# EAGLE design dual HX711 loadcell hytech v1.1 (EAGLE 9.5.0)
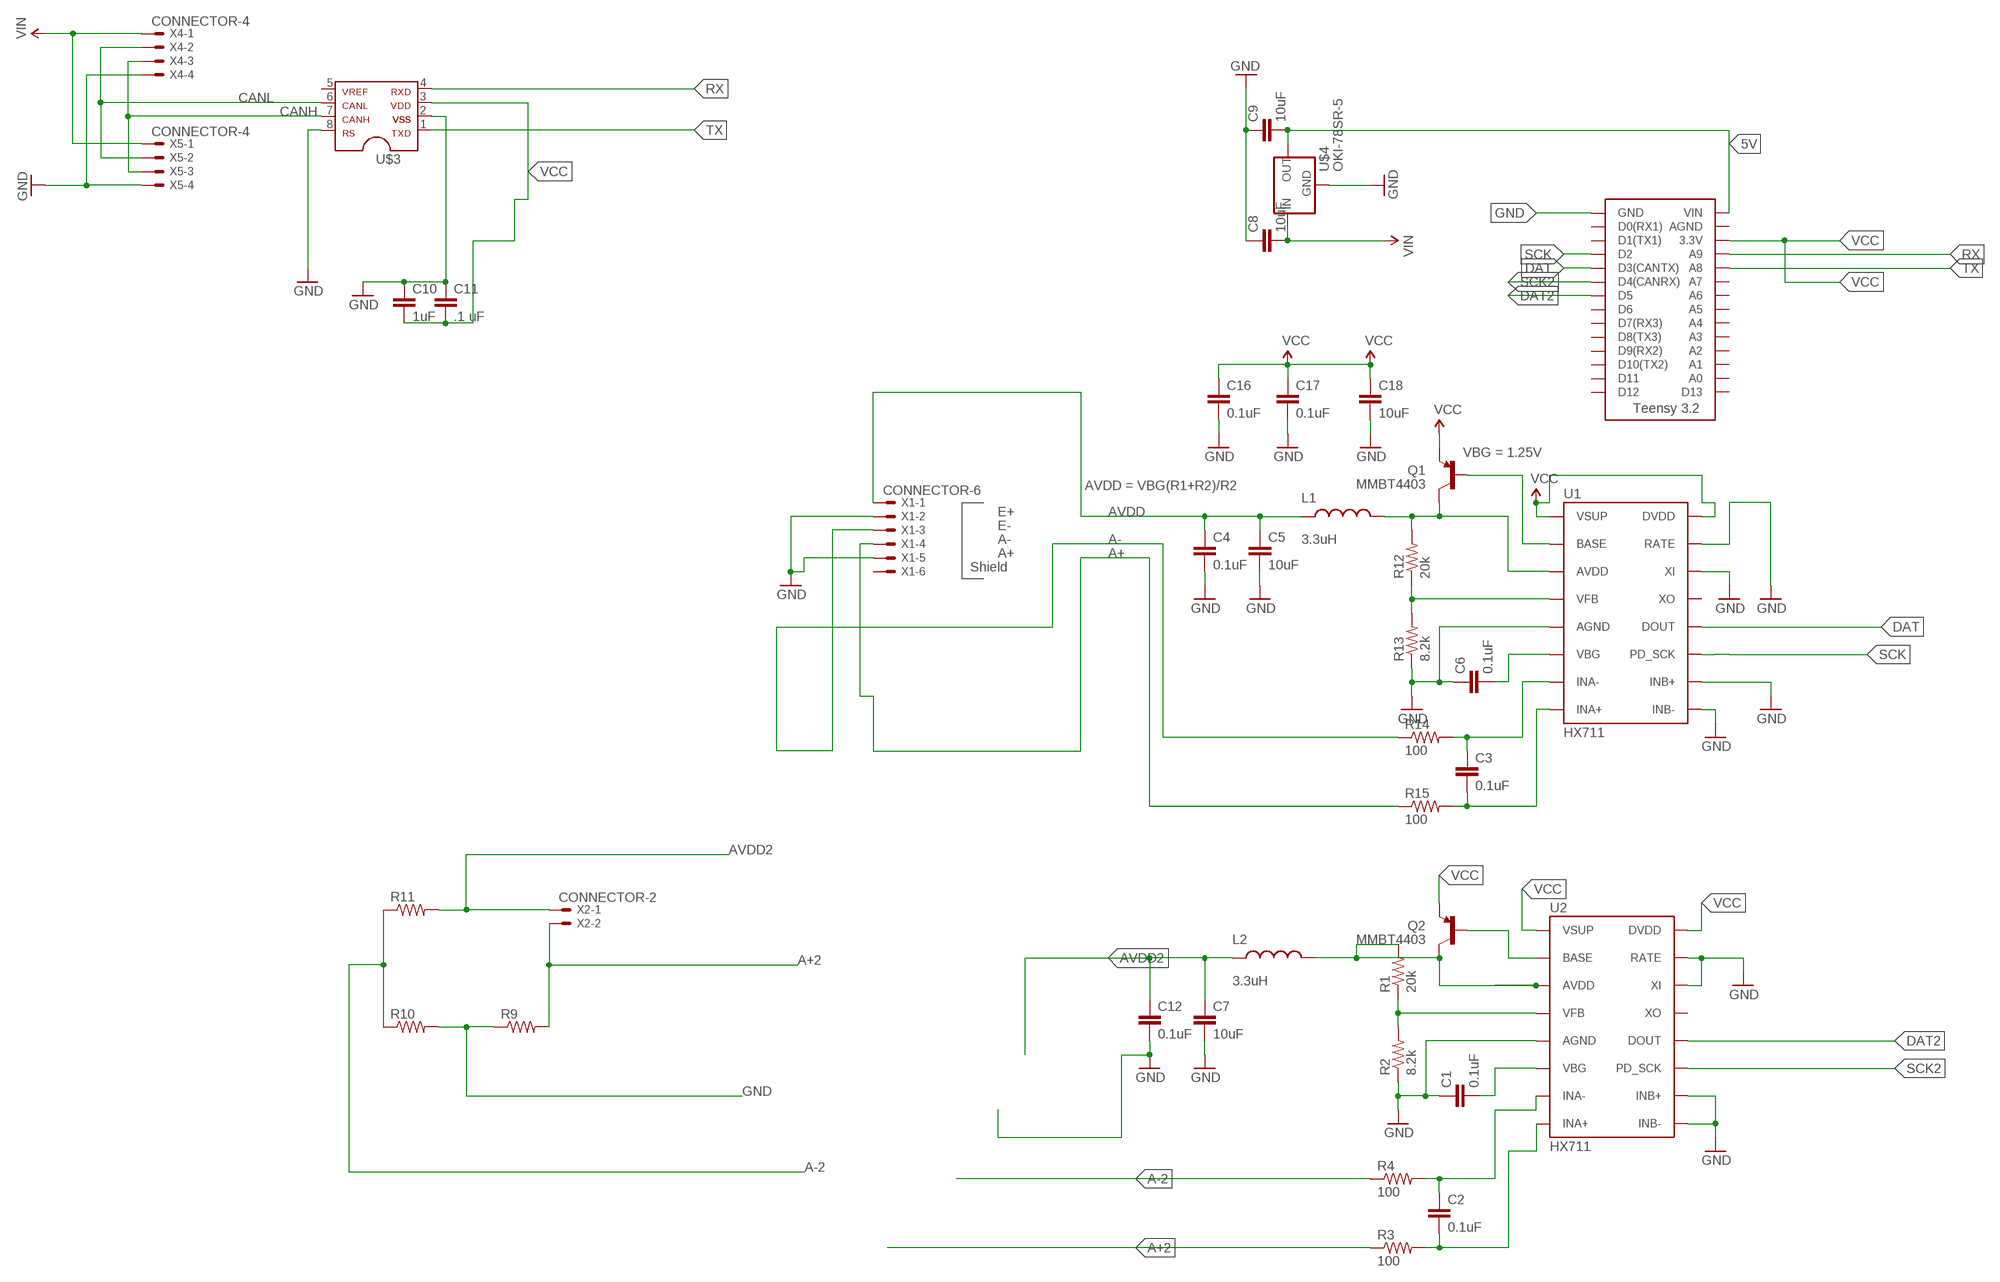
[diagram p0: schematic, sheet 1]

## Parts
C1  0.1uF  CAP0805  [0805]
C2  0.1uF  CAP0805  [0805]
C3  0.1uF  CAP0805  [0805]
C4  0.1uF  CAP0805  [0805]
C5  10uF  CAP0805  [0805]
C6  0.1uF  CAP0805  [0805]
C7  10uF  CAP0805  [0805]
C8  10uF  CAP0805  [0805]
C9  10uF  CAP0805  [0805]
C10  1uF  CAP0805  [0805]
C11  .1 uF  CAP0805  [0805]
C12  0.1uF  CAP0805  [0805]
C16  0.1uF  CAP0805  [0805]
C17  0.1uF  CAP0805  [0805]
C18  10uF  CAP0805  [0805]
L1  3.3uH  INDUCTOR0805-IND  [0805]
L2  3.3uH  INDUCTOR0805-IND  [0805]
Q1  MMBT4403  TRANSISTOR_PNPMMBT4403  [SOT23-3]
Q2  MMBT4403  TRANSISTOR_PNPMMBT4403  [SOT23-3]
R1  20k  RESISTOR0805-RES  [0805]
R2  8.2k  RESISTORAXIAL-0.3  [AXIAL-0.3]
R3  100  RESISTORAXIAL-0.3  [AXIAL-0.3]
R4  100  RESISTORAXIAL-0.3  [AXIAL-0.3]
R9  RESISTOR0805-RES  [0805]
R10  RESISTOR0805-RES  [0805]
R11  RESISTOR0805-RES  [0805]
R12  20k  RESISTOR0805-RES  [0805]
R13  8.2k  RESISTORAXIAL-0.3  [AXIAL-0.3]
R14  100  RESISTORAXIAL-0.3  [AXIAL-0.3]
R15  100  RESISTORAXIAL-0.3  [AXIAL-0.3]
U1  HX711  HX711HX711  [SO16]
U2  HX711  HX711HX711  [SO16]
U$1  TEENSY_3.2_SIMPLE  [TEENSY_3.2_SIMPLE]
U$3  MCP2551  [SOIC-08]
U$4  OKI-78SR-5  [OKI-78SR]
X1  CONNECTOR-6  [MINIFIT_5566-6]
X2  CONNECTOR-2  [MINIFIT_5566-2]
X4  CONNECTOR-4  [MINIFIT_5566-4]
X5  CONNECTOR-4  [MINIFIT_5566-4]

## Nets
5V: C9.2 U$1.VIN U$4.3(OUT)
A+: R15.P$1 X1.4
A+2: R3.P$1 R9.2 X2.2
A-: R14.P$1 X1.3
A-2: R4.P$1 R10.1 R11.1
AVDD: C4.1 C5.1 L1.1 X1.1
AVDD2: C7.1 C12.1 L2.1 R11.2 X2.1
CANH: U$3.7 X4.3 X5.3
CANL: U$3.6 X4.2 X5.2
DAT: U1.12(DOUT) U$1.D3(CANTX)
DAT2: U2.12(DOUT) U$1.D5
GND: C1.1 C4.2 C5.2 C6.1 C7.2 C8.1 C9.1 C10.1 C11.1 C12.2 C16.2 C17.2 C18.2 R2.P$1 R9.1 R10.2 R13.P$1 U1.5(AGND) U1.9(INB-) U1.10(INB+) U1.14(XI) U1.15(RATE) U2.5(AGND) U2.9(INB-) U2.10(INB+) U2.14(XI) U2.15(RATE) U$1.GND U$3.2 U$3.8 U$4.2(GND) X1.2 X1.5 X4.4 X5.4
N$1: Q2.1(B) U2.2(BASE)
N$2: C3.1 R14.P$2 U1.7(INA-)
N$3: C3.2 R15.P$2 U1.8(INA+)
N$4: Q1.1(B) U1.2(BASE)
N$5: L1.2 Q1.3(C) R12.2 U1.3(AVDD)
N$6: R12.1 R13.P$2 U1.4(VFB)
N$7: C6.2 U1.6(VBG)
N$8: C2.1 R4.P$2 U2.7(INA-)
N$9: R1.1 R2.P$2 U2.4(VFB)
N$10: C1.2 U2.6(VBG)
N$11: L2.2 Q2.3(C) R1.2 U2.3(AVDD)
N$12: C2.2 R3.P$2 U2.8(INA+)
RX: U$1.A9 U$3.4
SCK: U1.11(PD_SCK) U$1.D2
SCK2: U2.11(PD_SCK) U$1.D4(CANRX)
TX: U$1.A8 U$3.1
VCC: C10.2 C11.2 C16.1 C17.1 C18.1 Q1.2(E) Q2.2(E) U1.1(VSUP) U1.16(DVDD) U2.1(VSUP) U2.16(DVDD) U$1.3.3V U$3.3
VIN: C8.2 U$4.1(IN) X4.1 X5.1
Unconnected: U1.13(XO) U2.13(XO) U$1.A0 U$1.A1 U$1.A2 U$1.A3 U$1.A4 U$1.A5 U$1.A6 U$1.A7 U$1.AGND U$1.D0(RX1) U$1.D1(TX1) U$1.D6 U$1.D7(RX3) U$1.D8(TX3) U$1.D9(RX2) U$1.D10(TX2) U$1.D11 U$1.D12 U$1.D13 U$3.5 X1.6

## Notes on the sheet
- VBG = 1.25V
- AVDD = VBG(R1+R2)/R2
- E+
- E-
- A-
- A+
- Shield

## Library data of the parts
C1-C12 C16-C18 = HyTechDevices:CAP: Capacitor Standard 0603 ceramic capacitor, and 0.1" leaded capacitor.
L1 L2 = SparkFun-Passives:INDUCTOR: Inductors Basic Inductor/Choke - 0603 and 1206. Footprints are not proven and vary greatly between part numbers. INDUCTOR POWER 3.3UH 4.0A SMD 0.197" L x 0.197" W x 0.177" H (5.00mm x 5.00mm x 4.50mm); PROD_ID: NDUC-13076
Q1 Q2 = SparkFun-DiscreteSemi:TRANSISTOR_PNP: Generic PNP BJT Double check pinouts against datasheets- not all devices are the same! MMBT3906 - 40V 200mA SOT-23 (TRANS-08052) MMBT4403 - 40V 600mA SOT-23 (TRANS-09245); PROD_ID: TRANS-09245
R1-R4 R9-R15 = HyTechDevices:RESISTOR: Resistor Basic schematic elements and footprints for 0603, 1206, and PTH resistors.
U1 U2 = Testing:HX711; PROD_ID: IC-12445
U$1 = HyTechDevices:TEENSY_3.2_SIMPLE: Simple version of the Teensy 3.2 board that only uses the 2 main rows of pins, not the inner pins or the pins opposite the usb port.
U$3 = HyTechDevices:MCP2551: MCP2551 High-Speed CAN Transceiver Product Webpage <https://www.microchip.com/wwwproducts/en/MCP2551> Datasheet <http://ww1.microchip.com/downloads/en/DeviceDoc/21667f.pdf> This device is outdated It is replaced by MCP2561. Comparison Page <https://www.microchip.com/wwwproducts/ProductCompare/MCP2551/MCP2561> Product Webpage <https://www.microchip.com/wwwproducts/en/MCP2561> Datasheet <http://ww1.microchip.com/downloads/en/DeviceDoc/20005167C.pdf>
U$4 = HyTechDevices:OKI-78SR-5: Murata OKI-78SR 5V 1.5A Non-Isolated Switching Regulator DC/DC - Datasheet <https://power.murata.com/data/power/oki-78sr.pdf>
X1 = HyTechDevices:CONNECTOR-6: Mini-Fit Junior connector 6 pole Source: http://www.molex.com; MPN: 95566-61002; OC_FARNELL: unknown; OC_NEWARK: 22K8620
X2 = HyTechDevices:CONNECTOR-2: Mini-Fit Junior connector 2 pole Source: http://www.molex.com; OC_FARNELL: 1822072; OC_NEWARK: unknown
X4 X5 = HyTechDevices:CONNECTOR-4: Mini-Fit Junior connector 4 pole Source: http://www.molex.com; OC_FARNELL: unknown; OC_NEWARK: unknown

## Board
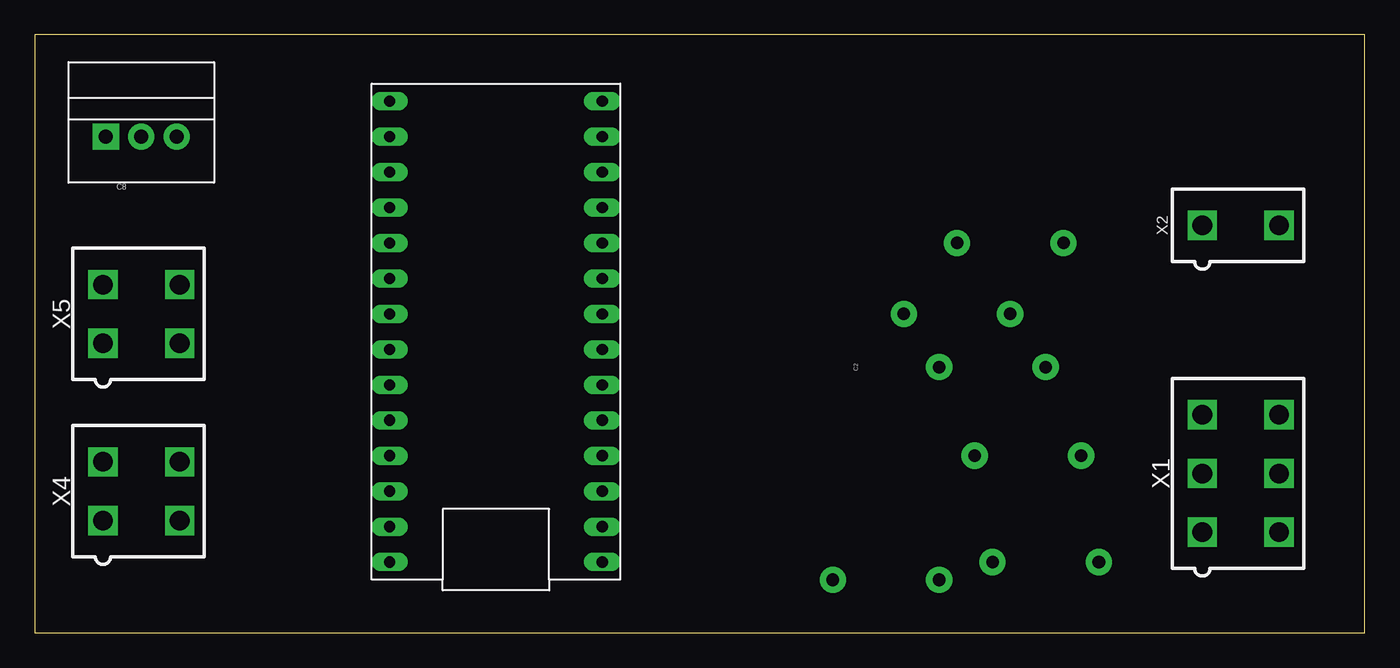
[diagram p1: board, top side]
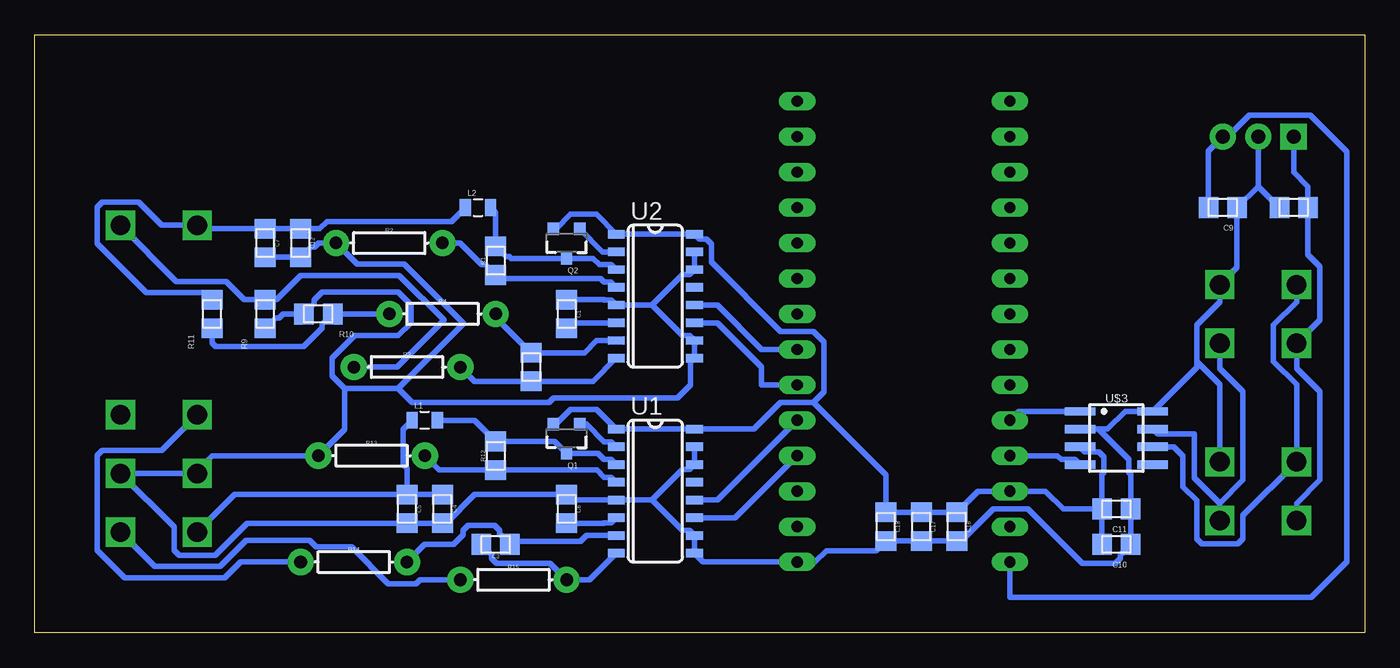
[diagram p2: board, bottom side, seen from below]

Size 95.23 x 42.85 mm. Coordinates in mm from the lower left corner, seen from the top.
Outline: 0,0 95.23,0 95.23,42.85 0,42.85 0,0
Copper layers (1*16): Top 0.035mm / dielectric 1.5mm / Bottom 0.035mm
Design rules "default *": minimum track width 6mil, minimum drill 0.35mm, track to track 16mil, track to pad 16mil, pad to pad 16mil, via to via 16mil, smd to smd 16mil, copper to edge 40mil, drill to drill 6mil, minimum pad ring 10mil, minimum via ring 8mil, stop-mask expansion 4mil, vias tented up to drill 0mil, thermal gap 10mil

### Footprints (pad centres in the part's own frame; a part is rotated, then mirrored left to right if it is on the bottom)
0805 = smd 1.4 x 1.5: 1 -1.025,0; 2 1.025,0
0805' = smd 0.8 x 1.2: 1 -0.9,0; 2 0.9,0
SOT23-3 = smd 0.8 x 0.9: 1 -0.95,-1; 2 0.95,-1; 3 0,1.1
AXIAL-0.3 = drill 0.9 pad 1.88: P$1 -3.81,0; P$2 3.81,0
SO16 = smd 0.6 x 1.2: 1 -4.445,-2.8; 2 -3.175,-2.8; 3 -1.905,-2.8; 4 -0.635,-2.8; 5 0.635,-2.8; 6 1.905,-2.8; 7 3.175,-2.8; 8 4.445,-2.8; 9 4.445,2.8; 10 3.175,2.8; 11 1.905,2.8; 12 0.635,2.8; 13 -0.635,2.8; 14 -1.905,2.8; 15 -3.175,2.8; 16 -4.445,2.8
TEENSY_3.2_SIMPLE = drill 0.8 long: 3.3V 16.51,29.21; A0 16.51,3.81; A1 16.51,6.35; A2 16.51,8.89; A3 16.51,11.43; A4 16.51,13.97; A5 16.51,16.51; A6 16.51,19.05; A7 16.51,21.59; A8 16.51,24.13; A9 16.51,26.67; AGND 16.51,31.75; D0(RX1) 1.27,31.75; D1(TX1) 1.27,29.21; D2 1.27,26.67; D3(CANTX) 1.27,24.13; D4(CANRX) 1.27,21.59; D5 1.27,19.05; D6 1.27,16.51; D7(RX3) 1.27,13.97; D8(TX3) 1.27,11.43; D9(RX2) 1.27,8.89; D10(TX2) 1.27,6.35; D11 1.27,3.81; D12 1.27,1.27; D13 16.51,1.27; GND 1.27,34.29; VIN 16.51,34.29
SOIC-08 = smd 0.6 x 2.2: 1 -1.905,-2.6; 2 -0.635,-2.6; 3 0.635,-2.6; 4 1.905,-2.6; 5 1.905,2.6; 6 0.635,2.6; 7 -0.635,2.6; 8 -1.905,2.6
OKI-78SR = drill 1 pad 1.88 square: 1 -2.54,0 | drill 1 pad 1.88: 2 0,0; 3 2.54,0
MINIFIT_5566-6 = drill 1.4 square: 1 4.2,-2.75; 2 0,-2.75; 3 -4.2,-2.75; 4 4.2,2.75; 5 0,2.75; 6 -4.2,2.75
MINIFIT_5566-2 = drill 1.4 square: 1 0,-2.75; 2 0,2.75
MINIFIT_5566-4 = drill 1.4 square: 1 2.1,-2.75; 2 -2.1,-2.75; 3 2.1,2.75; 4 -2.1,2.75

### Placement (x,y rotation side)
C1  57.15,22.86 270 bottom
C2  59.69,19.05 270 bottom
C3  62.23,6.35 180 bottom
C4  66.04,8.89 270 bottom
C5  68.58,8.89 270 bottom
C6  57.15,8.89 270 bottom
C7  78.74,27.94 270 bottom
C8  5.08,30.48 0 bottom
C9  10.16,30.48 180 bottom
C10  17.78,6.35 180 bottom
C11  17.78,8.89 180 bottom
C12  76.2,27.94 270 bottom
C16  29.21,7.62 270 bottom
C17  31.75,7.62 270 bottom
C18  34.29,7.62 270 bottom
L1  3.3uH  [0805']  67.31,15.24 0 bottom
L2  3.3uH  [0805']  63.5,30.48 0 bottom
Q1  57.15,13.97 180 bottom
Q2  57.15,27.94 180 bottom
R1  62.23,26.67 90 bottom
R2  69.85,27.94 0 bottom
R3  68.58,19.05 0 bottom
R4  66.04,22.86 0 bottom
R9  78.74,22.86 90 bottom
R10  74.93,22.86 180 bottom
R11  82.55,22.86 90 bottom
R12  62.23,12.7 90 bottom
R13  71.12,12.7 0 bottom
R14  72.39,5.08 0 bottom
R15  60.96,3.81 0 bottom
U1  50.8,10.16 270 bottom
U2  50.8,24.13 270 bottom
U$1  41.91,39.37 180 top
U$3  17.78,13.97 270 bottom
U$4  7.62,35.56 0 top
X1  86.36,11.43 270 top
X2  86.36,29.21 270 top
X4  7.62,10.16 270 top
X5  7.62,22.86 270 top

### Tracks (layer width: path | path; a pad name or v marks a point on that pad's centre or on a via)
5V
  Bottom 0.406: C9.2 11.18,34.53 U$4.3 9.81,35.56 8.26,37.11 3.89,37.11 1.27,34.49 1.27,5.08 3.81,2.54 25.4,2.54 U$1.VIN
A+
  Bottom 0.406: R15.P$1 67.66,3.81 67.94,3.53 69.92,3.53 72.56,6.18 75.1,6.18 75.56,6.63 80.1,6.63 81.97,4.76 86.64,4.76 X1.4
A+2
  Bottom 0.406: R3.P$1 69.29,19.05 65.94,22.41 69.13,25.61 76.2,25.61 77.92,23.89 R9.2 80.24,23.89 81.55,25.2 85.09,25.2 X2.2
A-
  Bottom 0.406: R14.P$1 80.5,5.08 81.63,3.94 88.79,3.94 90.77,5.93 90.77,12.73 90.41,13.09 86.15,13.09 X1.3
A-2
  Bottom 0.406: R4.P$1 R10.1 74.65,22.12 74.65,21.86 75.98,20.53 82.28,20.53 82.55,20.79 R11.1
AVDD
  Bottom 0.406: C4.1 C5.1 | C5.1 68.58,11.78 68.86,12.06 68.86,14.59 L1.1 | C5.1 80.92,9.92 X1.1
AVDD2
  Bottom 0.406: L2.1 65.39,29.49 74.3,29.49 74.83,28.96 C12.1 C7.1 83.37,28.96 X2.1 86.15,29.21 87.81,30.87 90.41,30.87 90.77,30.51 90.77,27.91 87.24,24.38 83.05,24.38 R11.2
CANH
  Bottom 0.406: X5.3 10.37,18.95 8.71,17.29 8.71,10.96 10.37,9.3 | U$3.7 14.82,14.25 12.2,14.25 12.2,11.13 10.37,9.3 | X4.3 10.37,9.3
CANL
  Bottom 0.406: X5.2 4.87,23.72 6.53,22.06 6.53,19.46 4.87,17.8 X4.2 8.71,8.42 8.71,6.76 9.07,6.4 11.67,6.4 12.03,6.76 12.03,9.49 13.01,10.47 13.01,12.7 13.65,13.34 U$3.6
DAT
  Bottom 0.406: U$1.D3(CANTX) 46.36,9.53 U1.12
DAT2
  Bottom 0.406: U$1.D5 43.18,20.32 46.36,23.5 U2.12
GND
  Bottom 0.406: 12.03,19.46 12.03,22.06 10.37,23.72 X5.4 9.14,26.2 C9.1 7.62,32 | X4.4 10.37,17.8 12.03,19.46 | C8.1 7.62,32 | 7.62,32 U$4.2 | 19.05,14.61 18.41,14.61 17.14,15.88 U$3.8 12.03,19.03 12.03,19.46 | 19.05,14.61 U$3.2 | 19.05,14.61 16.89,12.45 16.89,11.51 16.75,11.38 C11.1 C10.1 17.5,5.61 17.5,5.35 17.85,4.99 20.23,4.99 24.12,8.88 26.58,8.88 28.87,6.6 C16.2 C17.2 C18.2 34.99,5.89 38.54,5.89 39.35,5.08 U$1.GND 47.36,5.08 U1.9 U1.10 48.36,7.35 48.85,7.35 51.03,9.53 | U2.15 U2.14 48.36,25.68 48.85,25.68 51.03,23.5 | U1.15 U1.14 48.36,11.71 48.85,11.71 51.03,9.53 | 51.03,9.53 U1.5 56.76,9.53 C6.1 63.73,9.92 65.78,7.87 C4.2 C5.2 80.01,7.87 82.31,5.57 84.91,5.57 85.27,5.93 85.27,7.59 X1.5 83.82,11.43 | 51.03,23.5 U2.5 53.96,23.86 54.45,23.86 54.48,23.89 C1.1 | 51.03,23.5 48.85,21.32 48.36,21.32 U2.10 U2.9 48.26,19.43 48.26,17.78 49.2,16.84 58.09,16.84 58.42,16.51 68.22,16.51 69.21,17.5 | C7.2 C12.2 75.46,27.66 75.2,27.66 74.91,27.94 R2.P$1 72.14,26.42 68.8,26.42 64.54,22.16 69.21,17.5 | R9.1 78,22.57 77.74,22.57 77.45,22.86 R10.2 75.22,23.6 75.22,23.86 74.67,24.41 69.21,24.41 68.3,23.5 68.3,22.22 69.21,21.31 72.32,21.31 73.94,19.69 73.94,18.41 73.03,17.5 | X1.2 83.82,11.43 | 83.82,11.43 82.55,12.7 R13.P$1 73.03,14.6 73.03,17.5 | 73.03,17.5 69.21,17.5
N$1
  Bottom 0.406: Q2.1 54.56,27.3 U2.2
N$2
  Bottom 0.406: U1.7 55.72,6.99 56.15,6.55 61,6.55 C3.1 61.95,7.09 61.95,7.35 62.3,7.71 64.21,7.71 64.56,7.35 64.56,7.03 65.24,6.35 67.31,6.35 R14.P$2
N$3
  Bottom 0.406: U1.8 55.51,3.81 R15.P$2 58.33,4.99 62.16,4.99 62.52,5.35 62.52,5.61 C3.2
N$4
  Bottom 0.406: U1.2 53.96,13.7 54.45,13.7 55.73,14.97 Q1.1
N$5
  Bottom 0.406: U1.3 53.96,12.43 54.45,12.43 54.9,12.87 Q1.3 58.01,13.72 R12.2 63.75,15.24 L1.2
N$6
  Bottom 0.406: U1.4 53.96,11.16 54.45,11.16 54.97,11.68 R12.1 66.28,11.68 R13.P$2
N$7
  Bottom 0.406: C6.2 54.48,7.87 54.45,7.89 53.96,7.89 U1.6
N$8
  Bottom 0.406: U2.7 55,20.96 55.88,20.07 C2.1 62.23,22.62 R4.P$2
N$9
  Bottom 0.406: U2.4 53.96,25.12 54.45,25.12 54.73,25.4 61.98,25.4 R1.1 62.97,26.39 63.23,26.39 64.79,27.94 R2.P$2
N$10
  Bottom 0.406: U2.6 56.76,22.23 C1.2
N$11
  Bottom 0.406: U2.3 53.96,26.39 54.81,26.39 55.25,26.84 Q2.3 61.11,26.84 61.23,26.96 61.49,26.96 R1.2 62.23,30.11 L2.2
N$12
  Bottom 0.406: U2.8 55.26,18.03 C2.2 63.75,18.03 R3.P$2
RX
  Bottom 0.406: U$3.4 20.74,12.43 21.73,12.43 22.01,12.7 U$1.A9
SCK
  Bottom 0.406: U1.11 45.08,8.26 U$1.D2
SCK2
  Bottom 0.406: U$1.D4(CANRX) 43.18,17.78 43.18,19.05 46.36,22.23 U2.11
TX
  Bottom 0.406: U$3.1 24.76,15.88 U$1.A8
VCC
  Bottom 0.406: C11.2 C10.2 | U$3.3 20.02,12.97 19.03,12.97 18.67,12.62 18.67,11.51 18.8,11.38 C11.2 | C11.2 21.59,8.89 22.86,10.16 U$1.3.3V 27.69,10.16 C16.1 C17.1 C18.1 34.29,11.33 39.46,16.5 | 39.46,16.5 41.82,16.5 43.72,14.61 U1.16 U1.1 55.03,16.03 56.85,16.03 57.91,14.97 Q1.2 | 39.46,16.5 39.46,16.52 38.72,17.26 38.72,20.84 39.47,21.6 41.82,21.6 46.79,26.57 46.79,27.86 47.15,28.21 47.64,28.21 U2.16 U2.1 55.03,30 56.85,30 57.91,28.94 Q2.2
VIN
  Bottom 0.406: X4.1 4.87,9.3 3.21,10.96 3.21,17.29 4.87,18.95 X5.1 3.21,22.42 3.21,26.26 4.05,27.11 C8.2 4.05,32 5.08,33.02 U$4.1